# Altium schematic sheet hud_v300_MU.SchDoc
size A4; SheetNumber: 5; SheetTotal: 6
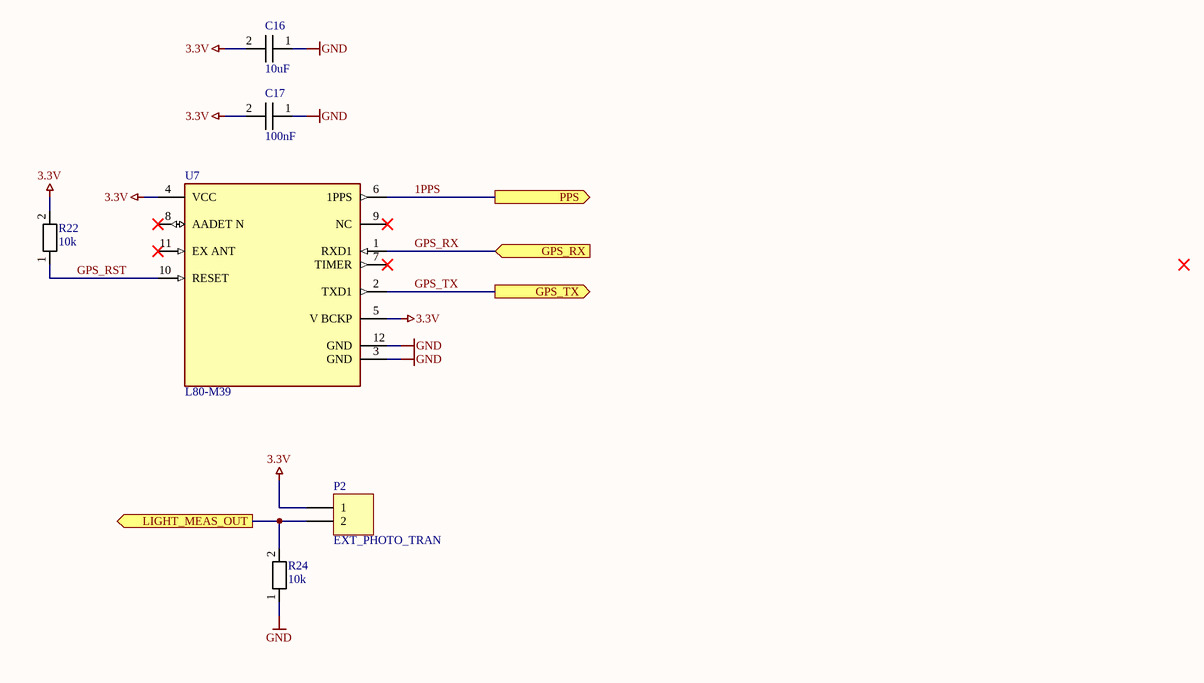
[diagram p0: hud_v300_MU.SchDoc]

## Parts
C16  10uF  [1210_C]
C17  100nF  [0805_C]
P2  EXT_PHOTO_TRAN  [HDR1X2]
R22  10k  [0805]
R24  10k  [0805]
U7  L80-M39  [L80-M39]

## Ports
GPS_RX (in, see hud_v300_MAIN[4B]), GPS_TX (out, see hud_v300_MAIN[4B]), LIGHT_MEAS_OUT (out, see hud_v300_MAIN[4B]), PPS (out, see hud_v300_MAIN[4B])

## Nets
3.3V: C16.2 C17.2 P2.1 R22.2 U7.4(VCC) U7.5(V_BCKP)
GND: C16.1 C17.1 R24.1 U7.3(GND) U7.12(GND)
1PPS: U7.6(1PPS) ; port PPS
GPS_RST: R22.1 U7.10(RESET)
GPS_RX: U7.1(RXD1) ; port GPS_RX
GPS_TX: U7.2(TXD1) ; port GPS_TX
LIGHT_MEAS_OUT: P2.2 R24.2 ; port LIGHT_MEAS_OUT

Not connected (* = marked no-connect by the designer): U7 7(TIMER)* 8(AADET_N)* 9(NC)* 11(EX_ANT)*

## Library data of the parts
C16 C17 = CAPACITOR
P2 = Header 2: Header, 2-Pin; LatestRevisionDate: 17-Jul-2002; LatestRevisionNote: Re-released for DXP Platform.; Publisher: Altium Limited
R22 R24 = RESISTOR: Parameter 1: 10k
U7 = L80-M39: QUECTEL GPS MODULE